# Altium schematic sheet comparator.SchDoc
size A4; SheetNumber: 2; SheetTotal: 3
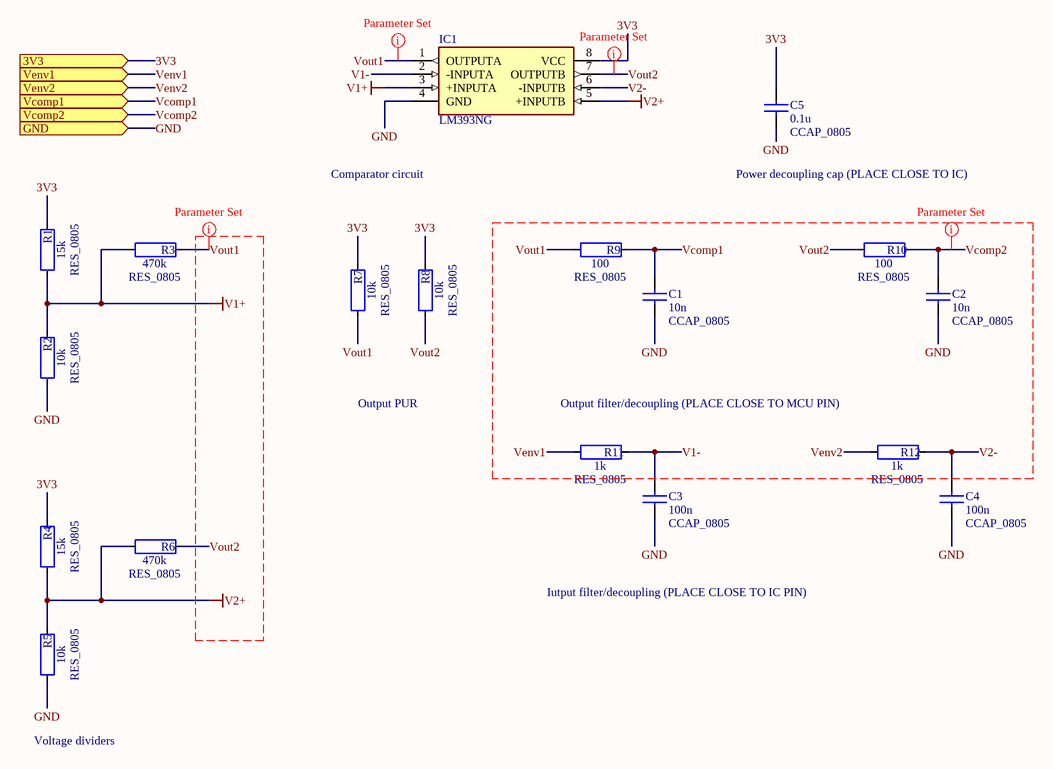
[diagram p0: comparator.SchDoc]

## Parts
C1  CCAP_0805  value 10n  [C0805]
C2  CCAP_0805  value 10n  [C0805]
C3  CCAP_0805  value 100n  [C0805]
C4  CCAP_0805  value 100n  [C0805]
C5  CCAP_0805  value 0.1u  [C0805]
IC1  LM393NG  [DIP794W56P254L959H533Q8B]
R1  RES_0805  value 15k  [R0805]
R2  RES_0805  value 10k  [R0805]
R3  RES_0805  value 470k  [R0805]
R4  RES_0805  value 15k  [R0805]
R5  RES_0805  value 10k  [R0805]
R6  RES_0805  value 470k  [R0805]
R7  RES_0805  value 10k  [R0805]
R8  RES_0805  value 10k  [R0805]
R9  RES_0805  value 100  [R0805]
R10  RES_0805  value 100  [R0805]
R11  RES_0805  value 1k  [R0805]
R12  RES_0805  value 1k  [R0805]

## Ports
3V3 (in), GND (in), Vcomp1 (in), Vcomp2 (in), Venv1 (in), Venv2 (in)

## Nets
V1+: IC1.3(+INPUTA) R1.1 R2.2 R3.1
V2+: IC1.5(+INPUTB) R4.1 R5.2 R6.1
3V3: C5.2 IC1.8(VCC) R1.2 R4.2 R7.2 R8.2 ; port 3V3
GND: C1.1 C2.1 C3.1 C4.1 C5.1 IC1.4(GND) R2.1 R5.1 ; port GND
V1-: C3.2 IC1.2(-INPUTA) R11.2
V2-: C4.2 IC1.6(-INPUTB) R12.2
Vcomp1: C1.2 R9.2 ; port Vcomp1
Vcomp2: C2.2 R10.2 ; port Vcomp2
Venv1: R11.1 ; port Venv1
Venv2: R12.1 ; port Venv2
Vout1: IC1.1(OUTPUTA) R3.2 R7.1 R9.1
Vout2: IC1.7(OUTPUTB) R6.2 R8.1 R10.1

## Layout directives
net class Signals: Vcomp2, Vout1, Vout2

## Notes on the sheet
- Comparator circuit
- Power decoupling cap (PLACE CLOSE TO IC)
- Output PUR
- Output filter/decoupling (PLACE CLOSE TO MCU PIN)
- Iutput filter/decoupling (PLACE CLOSE TO IC PIN)
- Voltage dividers
- Title:
- Author:
- Date:
- Time:
- Revision:
- Sheet
- of
- File:

## Library data of the parts
C1-C5 = CMP-00003-4: Generic 0805 cramic capacitor
IC1 = LM393NG: Integrated Circuit; Manufacturer_Name: onsemi; Datasheet Link: https://www.onsemi.com/download/data-sheet/pdf/LM393-D.PDF; Height: 5.33mm; Manufacturer_Part_Number: LM393NG; Mouser Part Number: 863-LM393NG; Mouser Price/Stock: https://www.mouser.co.uk/ProductDetail/onsemi/LM393NG?qs=2OtswVQKCOHsX%252BSjFJpNuQ%3D%3D; Arrow Part Number: LM393NG; Arrow Price/Stock: https://www.arrow.com/en/products/lm393ng/on-semiconductor
R1-R12 = CMP-00002-12: Generic 0805 resistor; Voltage Rating: 150V; Package: 0805